# Altium project ConversorSigmaDelta.PrjPcb
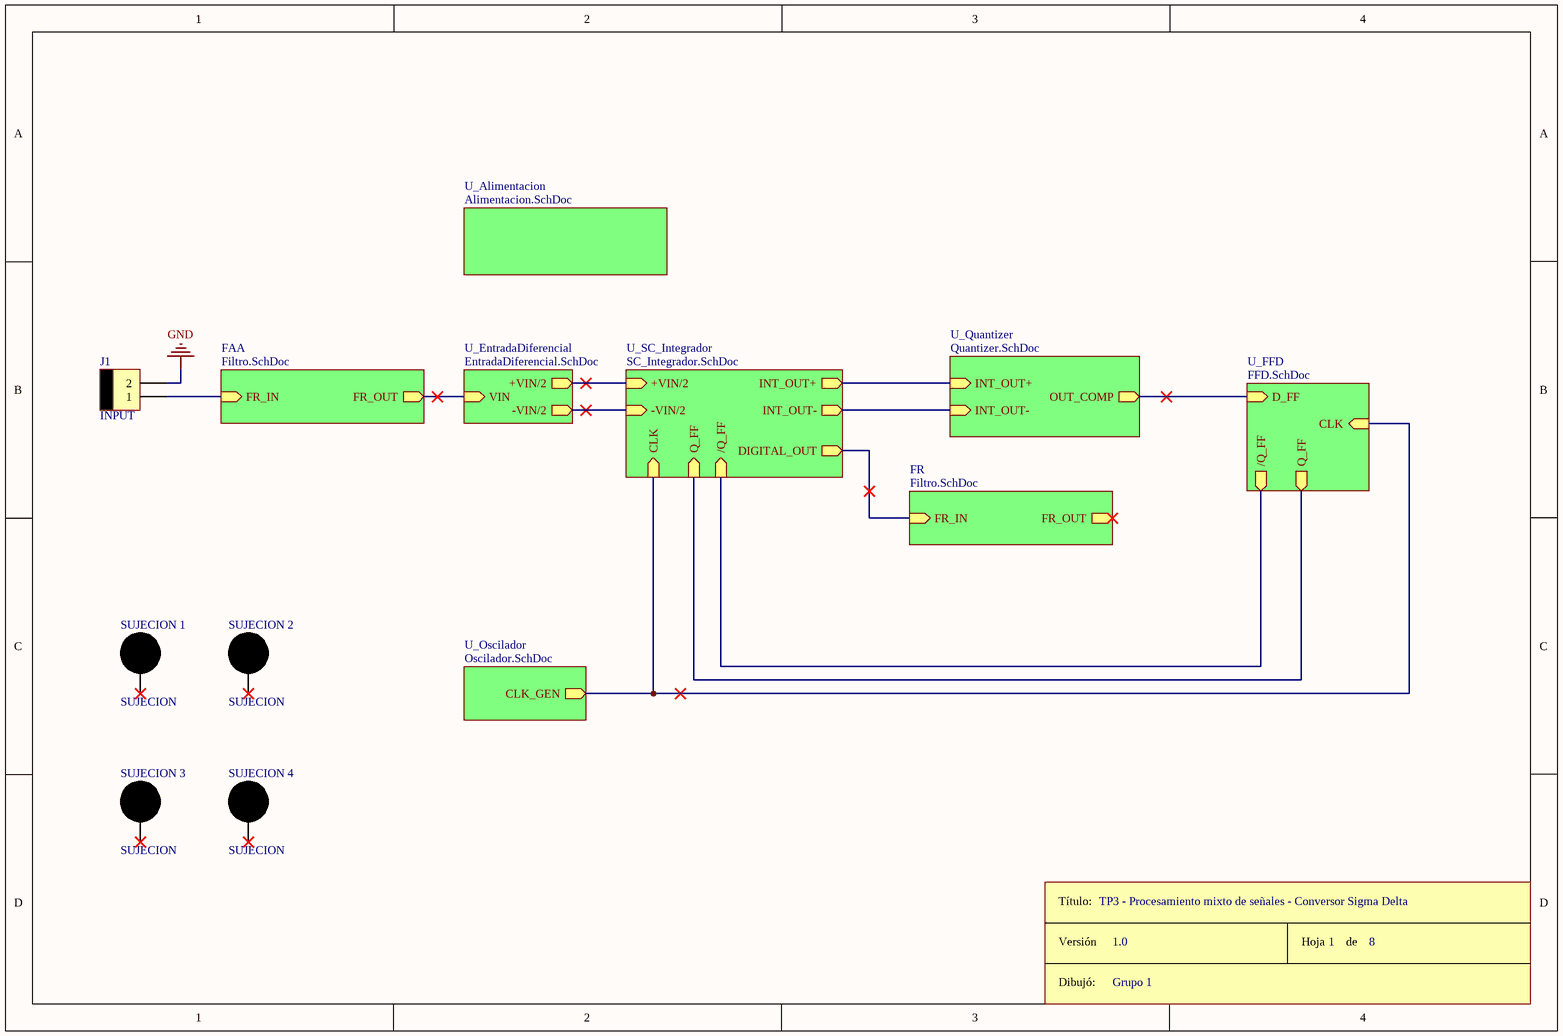
[diagram p0: ConversorSigmaDelta.SchDoc]
8 sheets, 88 parts. Net scope: hierarchical (ports join the sheet entries above them; power ports are global).
Board file: SigmaDelta.PcbDoc
Sheets:
  ConversorSigmaDelta.SchDoc
    U_EntradaDiferencial = EntradaDiferencial.SchDoc
    U_SC_Integrador = SC_Integrador.SchDoc
    U_Quantizer = Quantizer.SchDoc
    U_FFD = FFD.SchDoc
    U_Alimentacion = Alimentacion.SchDoc
    U_Oscilador = Oscilador.SchDoc
    FR = Filtro.SchDoc
    FAA = Filtro.SchDoc

## Sheet ConversorSigmaDelta.SchDoc
size A4

### Parts
J1  INPUT  [MOLEX2]
ROT6  Rótulo  (value not drawn)
SUJECION_1  SUJECION  [SUJECION (5.00MM - 3.50MM)]
SUJECION_2  SUJECION  [SUJECION (5.00MM - 3.50MM)]
SUJECION_3  SUJECION  [SUJECION (5.00MM - 3.50MM)]
SUJECION_4  SUJECION  [SUJECION (5.00MM - 3.50MM)]

### Sub-sheets
FAA = Filtro.SchDoc: FR_IN (in), FR_OUT (out)
FR = Filtro.SchDoc: FR_IN (in), FR_OUT (out)
U_Alimentacion = Alimentacion.SchDoc: no entries
U_EntradaDiferencial = EntradaDiferencial.SchDoc: +VIN/2 (out), -VIN/2 (out), VIN (in)
U_FFD = FFD.SchDoc: D_FF (in), CLK (in), Q_FF (out), /Q_FF (out)
U_Oscilador = Oscilador.SchDoc: CLK_GEN (out)
U_Quantizer = Quantizer.SchDoc: OUT_COMP (out), INT_OUT+ (in), INT_OUT- (in)
U_SC_Integrador = SC_Integrador.SchDoc: INT_OUT+ (out), INT_OUT- (out), Q_FF (in), +VIN/2 (in), /Q_FF (in), -VIN/2 (in), CLK (in), DIGITAL_OUT (out)

### Nets
GND: J1.2
CLK: sheet U_SC_Integrador/CLK, sheet U_FFD/CLK, sheet U_Oscilador/CLK_GEN
DAC_1BIT_A: sheet U_SC_Integrador/DIGITAL_OUT, sheet FR/FR_IN
VIN: sheet U_EntradaDiferencial/VIN, sheet FAA/FR_OUT
NetCa_2: sheet U_SC_Integrador/INT_OUT+, sheet U_Quantizer/INT_OUT+
NetCb_2: sheet U_SC_Integrador/INT_OUT-, sheet U_Quantizer/INT_OUT-
NetJ1_1: J1.1 ; sheet FAA/FR_IN
NetJ5_1: sheet U_SC_Integrador/Q_FF, sheet U_FFD/Q_FF
NetJ6_1: sheet U_Quantizer/OUT_COMP, sheet U_FFD/D_FF
NetR3D_2: sheet U_EntradaDiferencial/+VIN/2, sheet U_SC_Integrador/+VIN/2
NetU1_6: sheet U_EntradaDiferencial/-VIN/2, sheet U_SC_Integrador/-VIN/2
NetU2_2: sheet U_SC_Integrador//Q_FF, sheet U_FFD//Q_FF

Not connected (* = marked no-connect by the designer): SUJECION_1 1*; SUJECION_2 1*; SUJECION_3 1*; SUJECION_4 1*

### Notes on the sheet
- TP3 - Procesamiento mixto de señales - Conversor Sigma Delta
- 1.0
- Grupo 1
- 1
- 8
- (in symbol Rótulo) Título:; Versión; Hoja       de; Dibujó:

### Library data of the parts
J1 = MOLEX2

## Sheet EntradaDiferencial.SchDoc
size A4
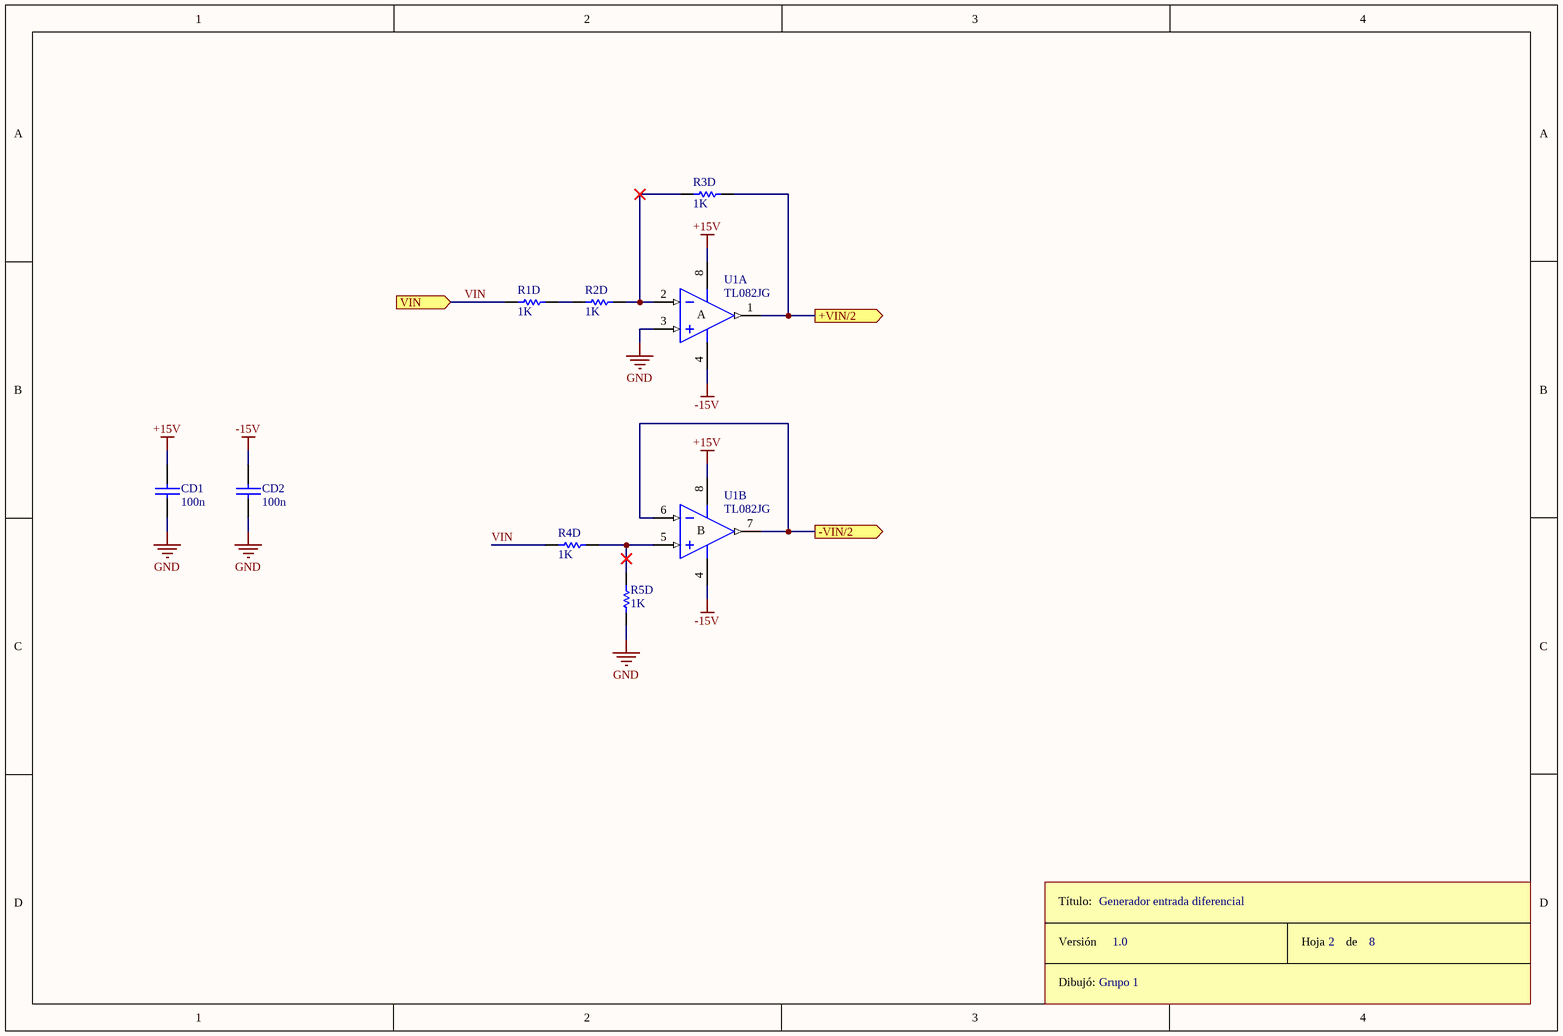
[diagram p1: EntradaDiferencial.SchDoc]

### Parts
CD1  100n  [CAP100]
CD2  100n  [CAP100]
R1D  1K  [RES300]
R2D  1K  [RES300]
R3D  1K  [RES300]
R4D  1K  [RES300]
R5D  1K  [RES300]
ROT1  Rótulo  (value not drawn)
U1  TL082JG  [JG008]  (parts A,B of 2)

### Ports
+VIN/2 (out), -VIN/2 (out), VIN (in)

### Nets
+15V: CD1.1 U1.8(V+)
-15V: CD2.1 U1.4(V-)
GND: CD1.2 CD2.2 R5D.1 U1.3(IN+)
VIN: R1D.2 R4D.2 ; port VIN
NetR1D_1: R1D.1 R2D.1
NetR2D_2: R2D.2 R3D.1 U1.2(IN-)
NetR3D_2: R3D.2 U1.1(OUT) ; port +VIN/2
NetR4D_1: R4D.1 R5D.2 U1.5(IN+)
NetU1_6: U1.6(IN-) U1.7(OUT) ; port -VIN/2

### Notes on the sheet
- Generador entrada diferencial
- Grupo 1
- 1.0
- 2
- 8
- (in symbol Rótulo) Título:; Versión; Hoja       de; Dibujó:
- (in symbol TL082JG, part A) A
- (in symbol TL082JG, part B) B

### Library data of the parts
CD1 CD2 = CAP
R1D R2D R3D R4D R5D = RES
U1 = TL082JG: JFET-Input Operational Amplifier; Published: 16-Jan-2001; LatestRevisionDate: 04-Mar-2005; LatestRevisionNote: Stylized 3D Model Added.; DatasheetVersion: Feb-1999; PackageVersion: Jan-1995; PackageReference: JG008; Publisher: Altium Limited; PackageDescription: DIP; 8 Leads; Row Spacing 7.62 mm; Pitch 2.54 mm; ComponentLink1Description: Manufacturer Link; ComponentLink1URL: http://www.ti.com/; ComponentLink2Description: Datasheet; ComponentLink2URL: http://www-s.ti.com/sc/ds/tl082.pdf

## Sheet SC_Integrador.SchDoc
size A4
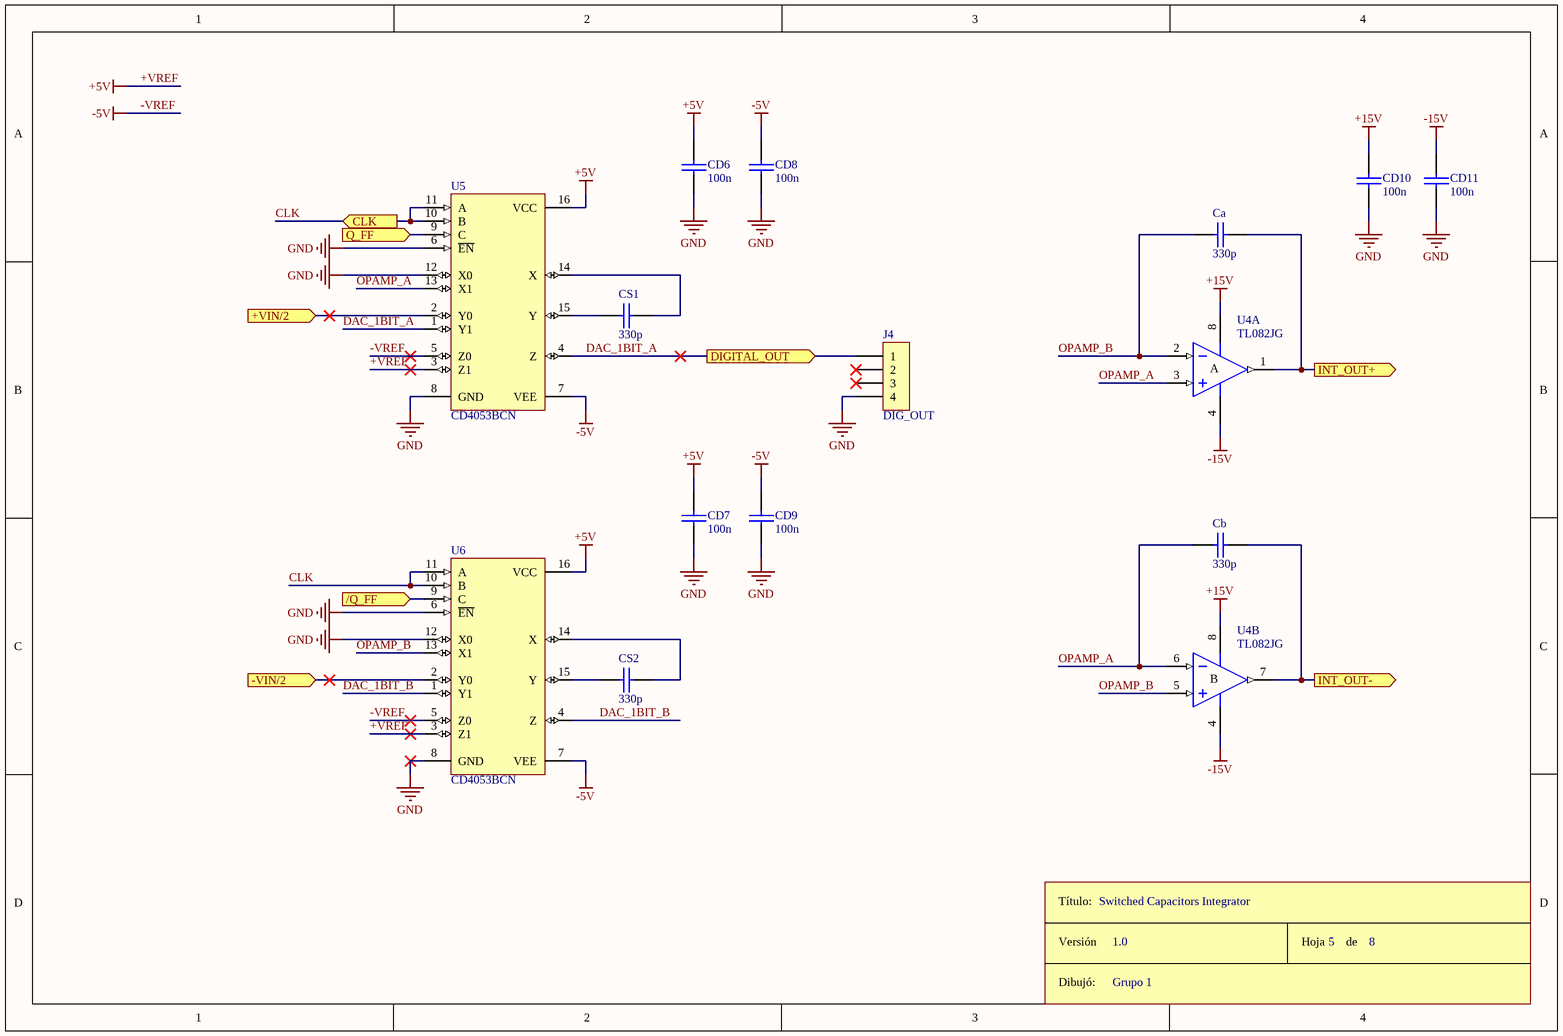
[diagram p2: SC_Integrador.SchDoc]

### Parts
Ca  330p  [CAP100]
Cb  330p  [CAP100]
CD6  100n  [CAP100]
CD7  100n  [CAP100]
CD8  100n  [CAP100]
CD9  100n  [CAP100]
CD10  100n  [CAP100]
CD11  100n  [CAP100]
CS1  330p  [CAP100]
CS2  330p  [CAP100]
J4  DIG_OUT  [SIP4]
ROT4  Rótulo  (value not drawn)
U4  TL082JG  [JG008]  (parts A,B of 2)
U5  CD4053BCN  [N16E]
U6  CD4053BCN  [N16E]

### Ports
+VIN/2 (in), -VIN/2 (in), /Q_FF (in), CLK (in), DIGITAL_OUT (out), INT_OUT+ (out), INT_OUT- (out), Q_FF (in)

### Nets
+15V: CD10.1 U4.8(V+)
+VREF: CD6.1 CD7.1 U5.3(Z1) U5.16(VCC) U6.3(Z1) U6.16(VCC)  [also labelled +5V]
-15V: CD11.1 U4.4(V-)
-VREF: CD8.1 CD9.1 U5.5(Z0) U5.7(VEE) U6.5(Z0) U6.7(VEE)  [also labelled -5V]
GND: CD6.2 CD7.2 CD8.2 CD9.2 CD10.2 CD11.2 J4.4 U5.6(~{EN}) U5.8(GND) U5.12(X0) U6.6(~{EN}) U6.8(GND) U6.12(X0)
CLK: U5.10(B) U5.11(A) U6.10(B) U6.11(A) ; port CLK
DAC_1BIT_A: J4.1 U5.1(Y1) U5.4(Z) ; port DIGITAL_OUT
DAC_1BIT_B: U6.1(Y1) U6.4(Z)
OPAMP_A: Cb.1 U4.3(IN+) U4.6(IN-) U5.13(X1)
OPAMP_B: Ca.1 U4.2(IN-) U4.5(IN+) U6.13(X1)
NetCa_2: Ca.2 U4.1(OUT) ; port INT_OUT+
NetCb_2: Cb.2 U4.7(OUT) ; port INT_OUT-
NetCS1_1: CS1.1 U5.14(X)
NetCS1_2: CS1.2 U5.15(Y)
NetCS2_1: CS2.1 U6.15(Y)
NetCS2_2: CS2.2 U6.14(X)
NetJ5_1: U5.9(C) ; port Q_FF
NetR3D_2: U5.2(Y0) ; port +VIN/2
NetU1_6: U6.2(Y0) ; port -VIN/2
NetU2_2: U6.9(C) ; port /Q_FF

Not connected (* = marked no-connect by the designer): J4 2* 3*

### Notes on the sheet
- Switched Capacitors Integrator
- 1.0
- Grupo 1
- 5
- 8
- (in symbol Rótulo) Título:; Versión; Hoja       de; Dibujó:
- (in symbol TL082JG, part A) A
- (in symbol TL082JG, part B) B

### Library data of the parts
Ca Cb CD6-CD11 CS1 CS2 = CAP
J4 = CON4
U4 = TL082JG: JFET-Input Operational Amplifier; Published: 16-Jan-2001; LatestRevisionDate: 04-Mar-2005; LatestRevisionNote: Stylized 3D Model Added.; DatasheetVersion: Feb-1999; PackageVersion: Jan-1995; PackageReference: JG008; Publisher: Altium Limited; PackageDescription: DIP; 8 Leads; Row Spacing 7.62 mm; Pitch 2.54 mm; ComponentLink1Description: Manufacturer Link; ComponentLink1URL: http://www.ti.com/; ComponentLink2Description: Datasheet; ComponentLink2URL: http://www-s.ti.com/sc/ds/tl082.pdf
U5 U6 = CD4053BCN: Triple 2-Channnel Analog Multiplexer/Demutiplexer; Published: 17-Jul-2002; LatestRevisionDate: 29-May-2009; LatestRevisionNote: Component Body Added.; DatasheetVersion: Jan-1999; PackageVersion: 2000; PackageReference: N16E; Publisher: Altium Limited; PackageDescription: DIP, 16-Pin, Row Spacing 7.62 mm, Pitch 2.54 mm; ComponentLink1Description: Manufacturer Link; ComponentLink1URL: http://www.fairchildsemi.com/; ComponentLink2Description: Datasheet; ComponentLink2URL: http://www.fairchildsemi.com/ds/CD%2FCD4052BC.pdf

## Sheet Quantizer.SchDoc
size A4
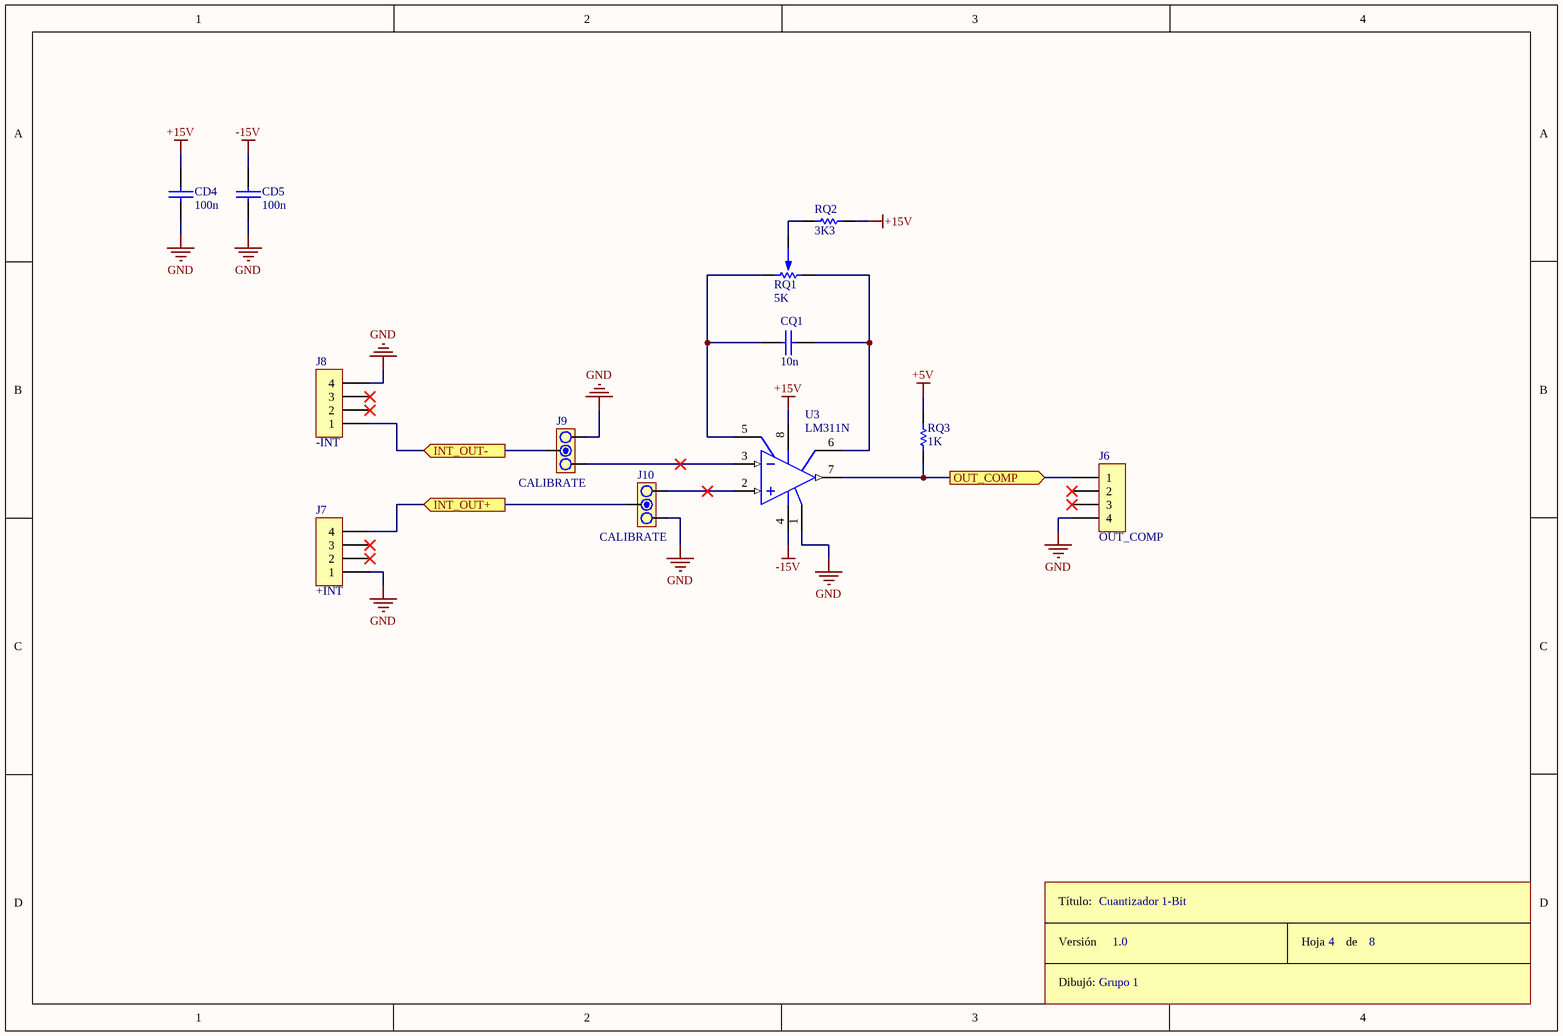
[diagram p3: Quantizer.SchDoc]

### Parts
CD4  100n  [CAP100]
CD5  100n  [CAP100]
CQ1  10n  [CAP100]
J6  OUT_COMP  [SIP4]
J7  +INT  [SIP4]
J8  -INT  [SIP4]
J9  CALIBRATE  [JUMPER3]
J10  CALIBRATE  [JUMPER3]
ROT3  Rótulo  (value not drawn)
RQ1  5K  [PRESET V]
RQ2  3K3  [RES300]
RQ3  1K  [RES300]
U3  LM311N  [626-05]

### Ports
INT_OUT+ (in), INT_OUT- (in), OUT_COMP (out)

### Nets
+5V: RQ3.2  [project net +VREF]
+15V: CD4.1 RQ2.2 U3.8(V+)
-15V: CD5.1 U3.4(V-)
GND: CD4.2 CD5.2 J6.4 J7.1 J8.4 J9.1 J10.3 U3.1(GND)
NetCa_2: J7.4 J10.2 ; port INT_OUT+
NetCb_2: J8.1 J9.2 ; port INT_OUT-
NetCQ1_1: CQ1.1 RQ1.1 U3.5(BAL)
NetCQ1_2: CQ1.2 RQ1.3 U3.6(BAL/STB)
NetJ6_1: J6.1 RQ3.1 U3.7(OUT) ; port OUT_COMP
NetJ9_3: J9.3 U3.3(IN-)
NetJ10_1: J10.1 U3.2(IN+)
NetRQ1_2: RQ1.2 RQ2.1

Not connected (* = marked no-connect by the designer): J6 2* 3*; J7 2* 3*; J8 2* 3*

### Notes on the sheet
- Cuantizador 1-Bit
- Grupo 1
- 1.0
- 4
- 8
- (in symbol Rótulo) Título:; Versión; Hoja       de; Dibujó:

### Library data of the parts
CD4 CD5 CQ1 = CAP
J6-J8 = CON4
J9 J10 = JUMPER3
RQ1 = PRESET
RQ2 RQ3 = RES
U3 = LM311N: High-Performance Voltage Comparator; Published: 17-Jul-2002; LatestRevisionDate: 06-Jun-2005; LatestRevisionNote: Stylized 3D Model Added.; DatasheetVersion: 1988; PackageReference: 626-05; Publisher: Altium Limited; PackageDescription: DIP; 8 Leads; Row Spacing 7.62 mm; Pitch 2.54 mm; ComponentLink1Description: Manufacturer Link; ComponentLink1URL: http://www.onsemi.com/site/products/taxonomy/0,4438,133,00.html

## Sheet FFD.SchDoc
size A4
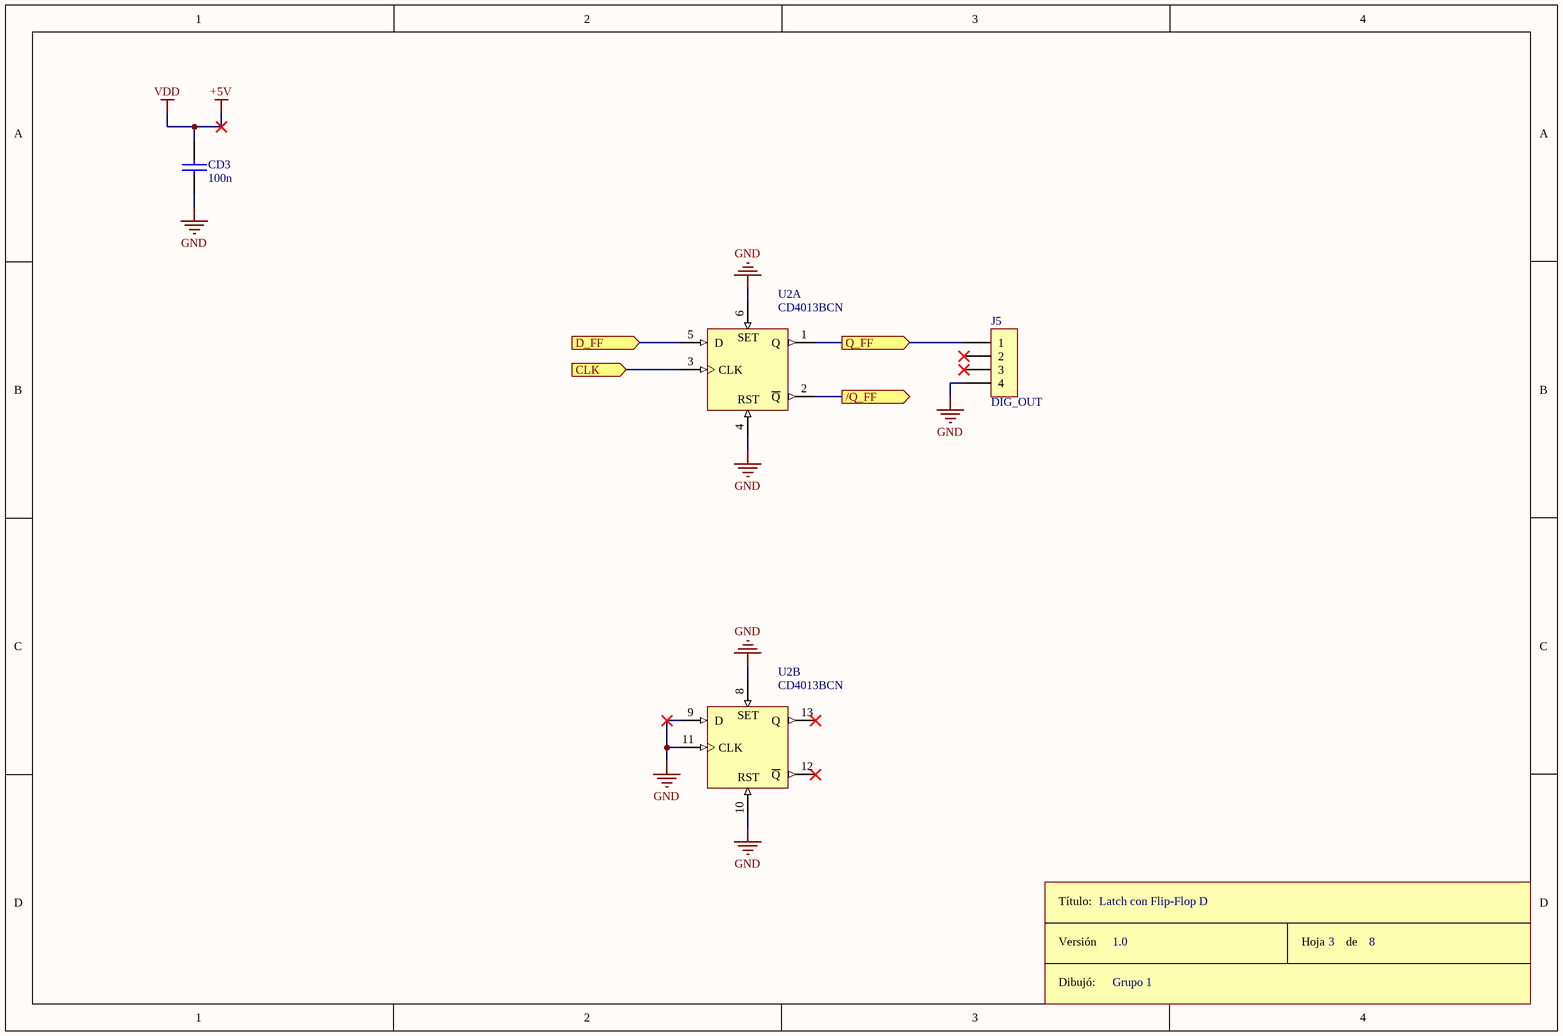
[diagram p4: FFD.SchDoc]

### Parts
CD3  100n  [CAP100]
J5  DIG_OUT  [SIP4]
ROT2  Rótulo  (value not drawn)
U2  CD4013BCN  [N14A]  (parts A,B of 2)

### Ports
/Q_FF (out), CLK (in), D_FF (in), Q_FF (out)

### Nets
+5V: CD3.1 U2.14(VDD)  [also labelled VDD]  [project net +VREF]
GND: CD3.2 J5.4 U2.4(RST) U2.6(S) U2.7(GND) U2.8(S) U2.9(D) U2.10(RST) U2.11(CLK)
CLK: U2.3(CLK) ; port CLK
NetJ5_1: J5.1 U2.1(Q) ; port Q_FF
NetJ6_1: U2.5(D) ; port D_FF
NetU2_2: U2.2(~{Q}) ; port /Q_FF

Not connected (* = marked no-connect by the designer): J5 2* 3*; U2 12(~{Q})* 13(Q)*

### Notes on the sheet
- Latch con Flip-Flop D
- 1.0
- Grupo 1
- 3
- 8
- (in symbol CD4013BCN, part A) SET
- (in symbol CD4013BCN, part B) SET
- (in symbol Rótulo) Título:; Versión; Hoja       de; Dibujó:

### Library data of the parts
CD3 = CAP
J5 = CON4
U2 = CD4013BCN: Dual D-Type Flip-Flop; Published: 17-Jul-2002; LatestRevisionDate: 29-May-2009; LatestRevisionNote: Component Body Added.; DatasheetVersion: Jan-1999; PackageVersion: 2000; PackageReference: N14A; Publisher: Altium Limited; PackageDescription: DIP, 14-Pin, Row Spacing 7.62 mm, Pitch 2.54 mm; ComponentLink1Description: Manufacturer Link; ComponentLink1URL: http://www.fairchildsemi.com/

## Sheet Alimentacion.SchDoc
size A4
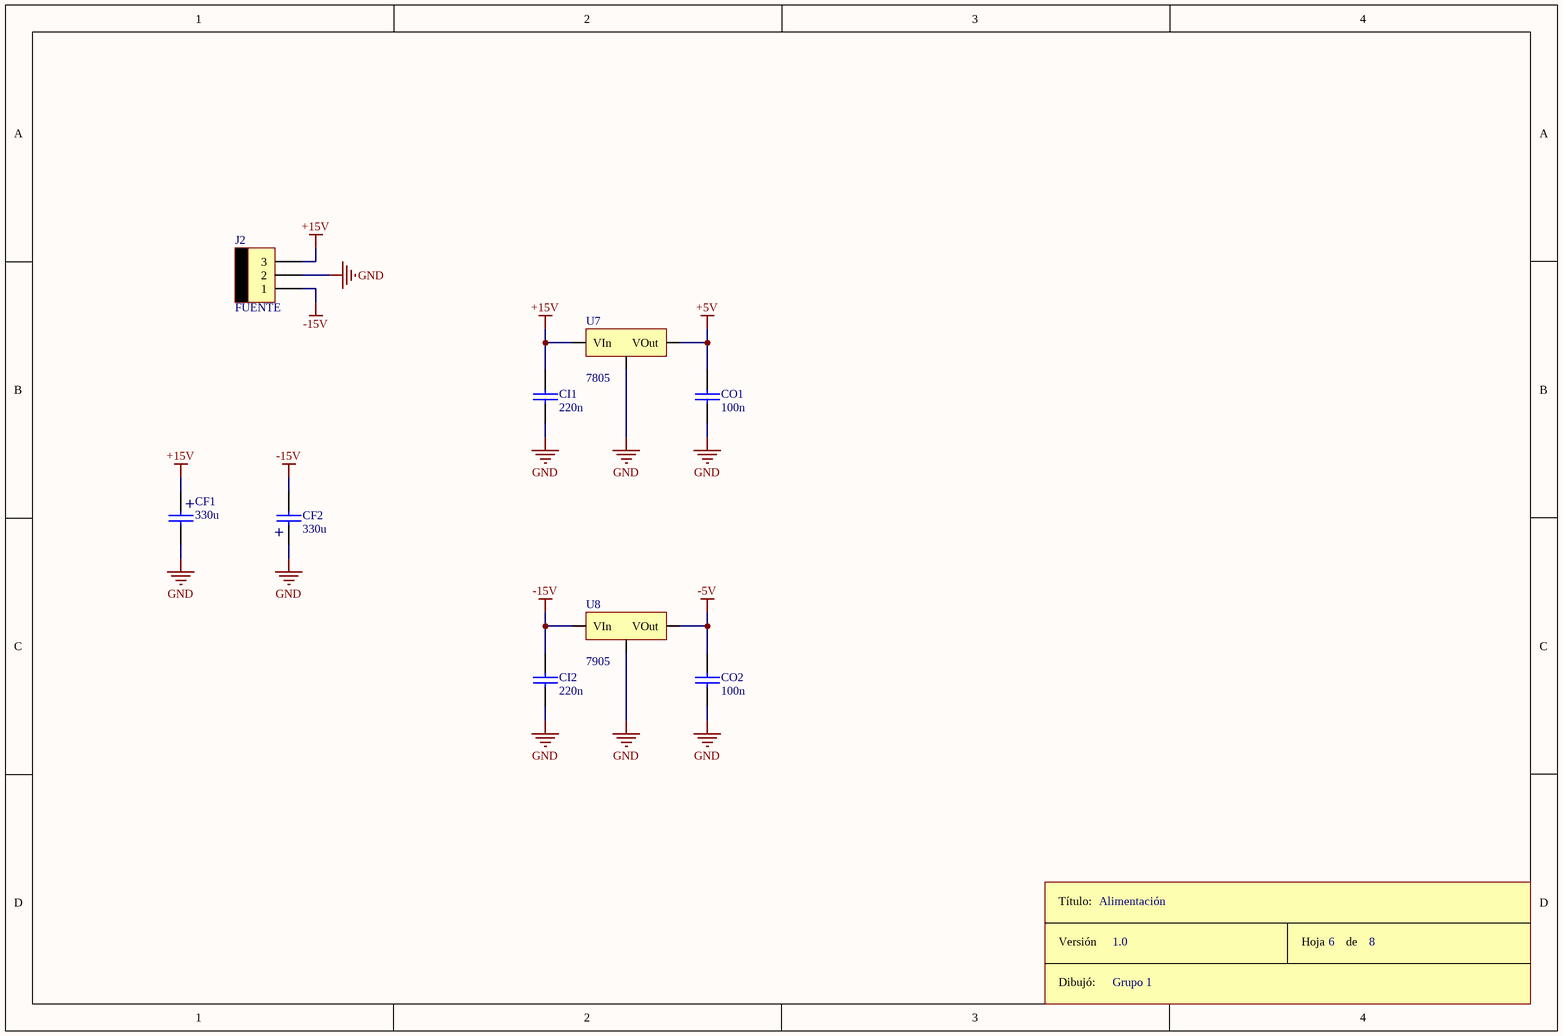
[diagram p5: Alimentacion.SchDoc]

### Parts
CF1  330u  [CAP200RP]
CF2  330u  [CAP200RP]
CI1  220n  [CAP100]
CI2  220n  [CAP100]
CO1  100n  [CAP100]
CO2  100n  [CAP100]
J2  FUENTE  [MOLEX3]
ROT5  Rótulo  (value not drawn)
U7  7805  [TO-220 V]
U8  7905  [TO-220 V]

### Nets
+5V: CO1.1 U7.3(VOut)  [project net +VREF]
+15V: CF1.1 CI1.1 J2.3 U7.1(VIn)
-5V: CO2.1 U8.3(VOut)  [project net -VREF]
-15V: CF2.2 CI2.1 J2.1 U8.2(VIn)
GND: CF1.2 CF2.1 CI1.2 CI2.2 CO1.2 CO2.2 J2.2 U7.2(GND) U8.1(GND)

### Notes on the sheet
- Alimentación
- 1.0
- Grupo 1
- 6
- 8
- (in symbol CAPPOL) +
- (in symbol Rótulo) Título:; Versión; Hoja       de; Dibujó:

### Library data of the parts
CF1 CF2 = CAPPOL
CI1 CI2 CO1 CO2 = CAP
J2 = MOLEX3
U7 = 78XX: REGULDOR POSITIVO
U8 = 79XX: REGULADOR NEGATIVO

## Sheet Oscilador.SchDoc
size A4
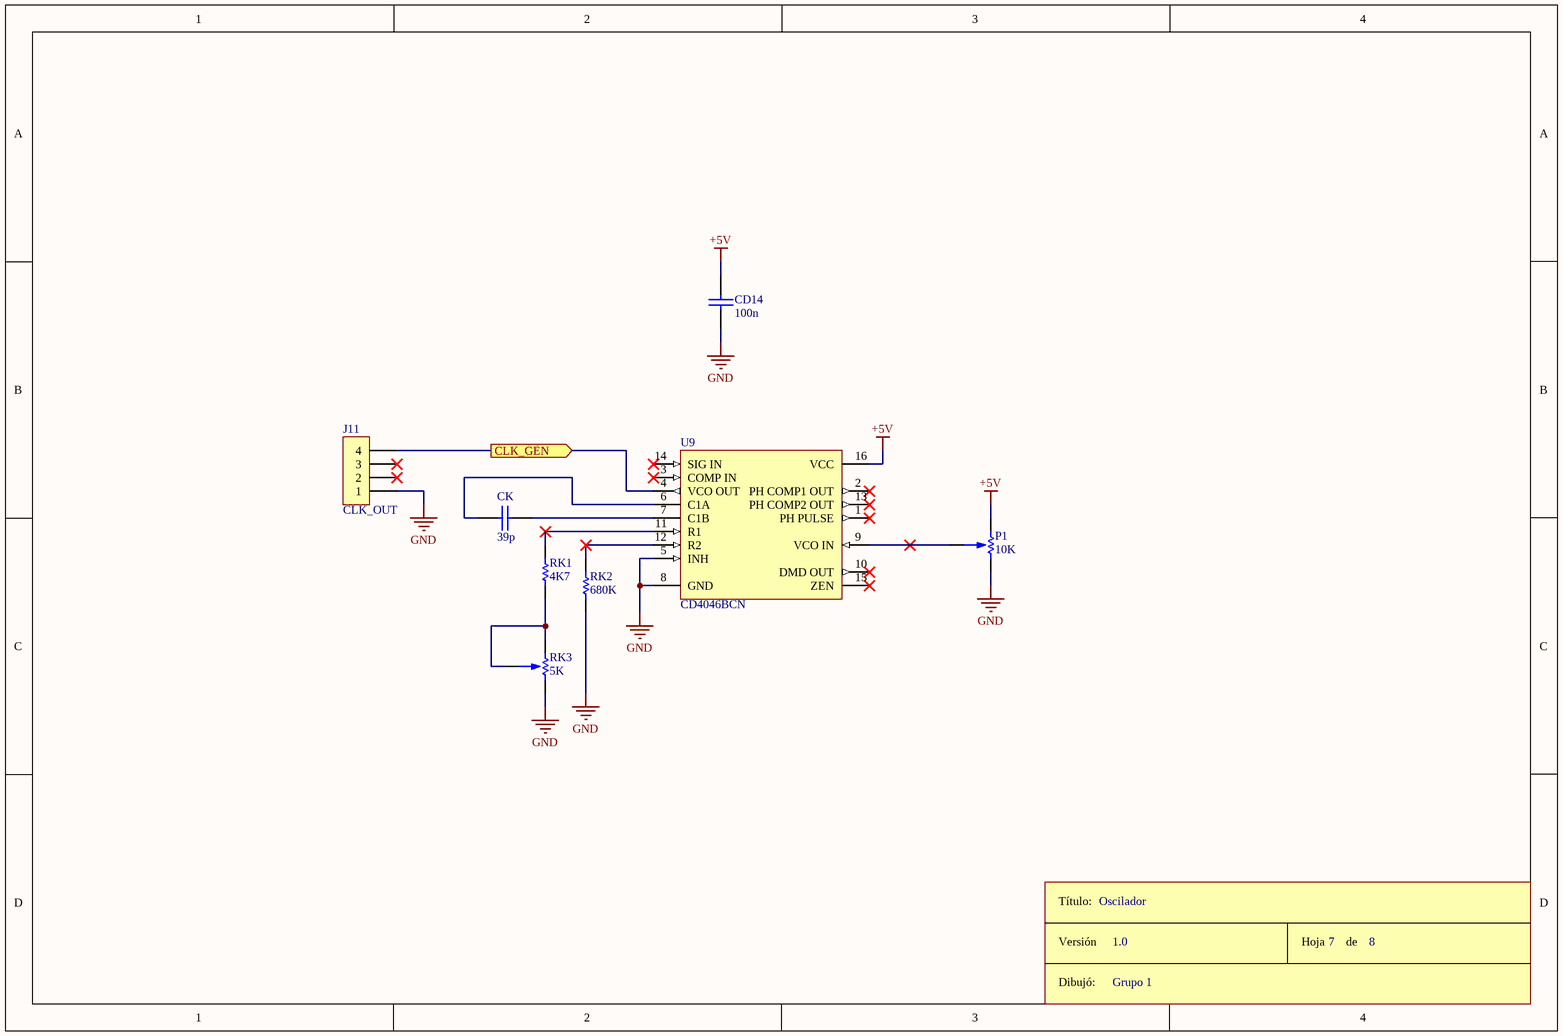
[diagram p6: Oscilador.SchDoc]

### Parts
CD14  100n  [CAP100]
CK  39p  [CAP100]
J11  CLK_OUT  [SIP4]
P1  10K  [PRESET V]
RK1  4K7  [RES300]
RK2  680K  [RES300]
RK3  5K  [PRESET V]
ROT7  Rótulo  (value not drawn)
U9  CD4046BCN  [N16E]

### Ports
CLK_GEN (out)

### Nets
+5V: CD14.1 P1.3 U9.16(VCC)  [project net +VREF]
GND: CD14.2 J11.1 P1.1 RK2.1 RK3.1 U9.5(INH) U9.8(GND)
CLK: J11.4 U9.4(VCO_OUT) ; port CLK_GEN
NetCK_1: CK.1 U9.6(C1A)
NetCK_2: CK.2 U9.7(C1B)
NetP1_2: P1.2 U9.9(VCO_IN)
NetRK1_1: RK1.1 RK3.2 RK3.3
NetRK1_2: RK1.2 U9.11(R1)
NetRK2_2: RK2.2 U9.12(R2)

Not connected (* = marked no-connect by the designer): J11 2* 3*; U9 1(PH_PULSE)* 2(PH_COMP1_OUT)* 3(COMP_IN)* 10(DMD_OUT)* 13(PH_COMP2_OUT)* 14(SIG_IN)* 15(ZEN)*

### Notes on the sheet
- Oscilador
- 1.0
- Grupo 1
- 7
- 8
- (in symbol Rótulo) Título:; Versión; Hoja       de; Dibujó:

### Library data of the parts
CD14 CK = CAP
J11 = CON4
P1 RK3 = PRESET
RK1 RK2 = RES
U9 = CD4046BCN: Micropower Phase-Locked Loop; Published: 17-Jul-2002; LatestRevisionDate: 04-Mar-2005; LatestRevisionNote: Stylized 3D Model Added.; DatasheetVersion: Jan-1999; PackageVersion: 2000; PackageReference: N16E; Publisher: Altium Limited; PackageDescription: DIP; 16 Leads; Row Spacing 7.62 mm; Pitch 2.54 mm; ComponentLink1Description: Manufacturer Link; ComponentLink1URL: http://www.fairchildsemi.com/; ComponentLink2Description: Datasheet; ComponentLink2URL: http://www.fairchildsemi.com/ds/CD%2FCD4046BC.pdf

## Sheet Filtro.SchDoc
size A4
Used 2 times, as channels FR, FAA. Parts and nets are listed once, with the designators drawn on the sheet.
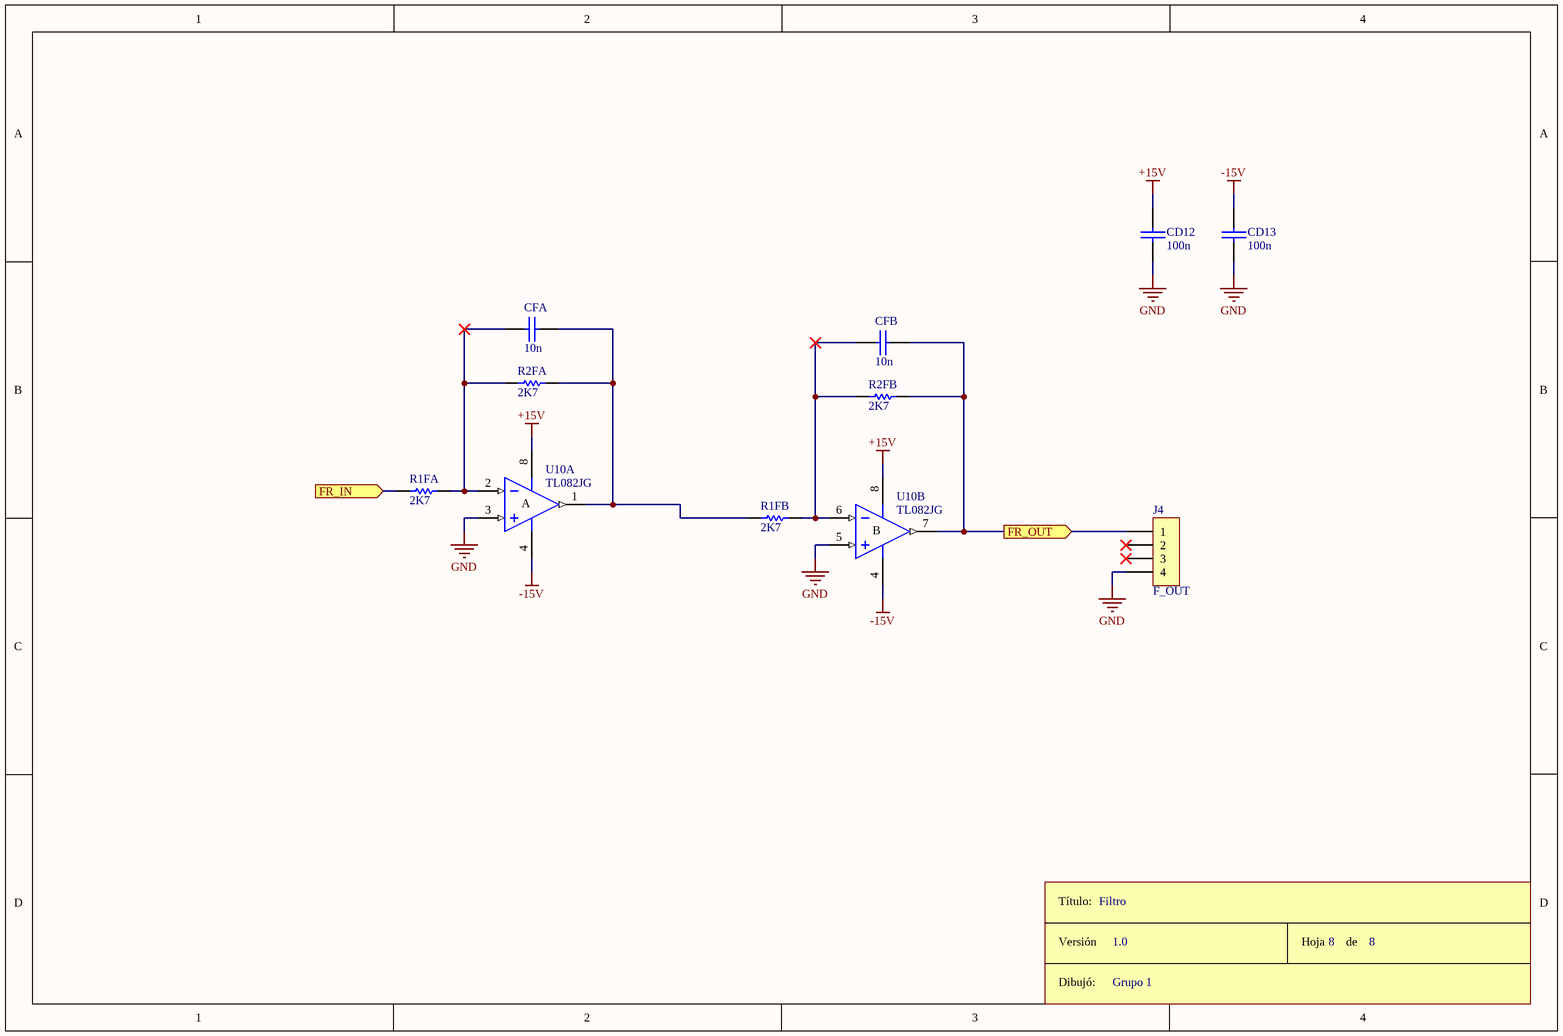
[diagram p7: Filtro.SchDoc]

### Parts
CD12  100n  [CAP100]
CD13  100n  [CAP100]
CFA  10n  [CAP100]
CFB  10n  [CAP100]
J4  F_OUT  [SIP4]
R1FA  2K7  [RES300]
R1FB  2K7  [RES400]
R2FA  2K7  [RES300]
R2FB  2K7  [RES300]
ROT8  Rótulo  (value not drawn)
U10  TL082JG  [JG008]  (parts A,B of 2)

### Ports
FR_IN (in), FR_OUT (out)

### Nets
+15V: CD12.1 U10.8(V+)
-15V: CD13.1 U10.4(V-)
GND: CD12.2 CD13.2 J4.4 U10.3(IN+) U10.5(IN+)
FR_IN: R1FA.1 ; port FR_IN
FR_OUT: CFB.2 J4.1 R2FB.2 U10.7(OUT) ; port FR_OUT
NetCFA_1: CFA.1 R1FA.2 R2FA.1 U10.2(IN-)
NetCFA_2: CFA.2 R1FB.1 R2FA.2 U10.1(OUT)
NetCFB_1: CFB.1 R1FB.2 R2FB.1 U10.6(IN-)

Not connected (* = marked no-connect by the designer): J4 2* 3*

### Channels
FR: designators end in _FR; ports FR_IN=DAC_1BIT_A FR_OUT=NetCFB_FR_2
FAA: designators end in _FAA; ports FR_IN=NetJ1_1 FR_OUT=VIN

### Notes on the sheet
- Filtro
- 1.0
- Grupo 1
- 8
- (in symbol Rótulo) Título:; Versión; Hoja       de; Dibujó:
- (in symbol TL082JG, part A) A
- (in symbol TL082JG, part B) B

### Library data of the parts
CD12 CD13 CFA CFB = CAP
J4 = CON4
R1FA R1FB R2FA R2FB = RES
U10 = TL082JG: JFET-Input Operational Amplifier; Published: 16-Jan-2001; LatestRevisionDate: 04-Mar-2005; LatestRevisionNote: Stylized 3D Model Added.; DatasheetVersion: Feb-1999; PackageVersion: Jan-1995; PackageReference: JG008; Publisher: Altium Limited; PackageDescription: DIP; 8 Leads; Row Spacing 7.62 mm; Pitch 2.54 mm; ComponentLink1Description: Manufacturer Link; ComponentLink1URL: http://www.ti.com/; ComponentLink2Description: Datasheet; ComponentLink2URL: http://www-s.ti.com/sc/ds/tl082.pdf

## Nets that join several sheets
+15V: EntradaDiferencial (CD1.1 U1.8), SC_Integrador (CD10.1 U4.8), Quantizer (CD4.1 RQ2.2 U3.8), Alimentacion (CF1.1 CI1.1 J2.3 U7.1), FR (CD12_FR.1 U10_FR.8), FAA (CD12_FAA.1 U10_FAA.8)
+VREF: SC_Integrador (6 pins), Quantizer (RQ3.2), FFD (CD3.1 U2.14), Alimentacion (CO1.1 U7.3), Oscilador (CD14.1 P1.3 U9.16)
-15V: EntradaDiferencial (CD2.1 U1.4), SC_Integrador (CD11.1 U4.4), Quantizer (CD5.1 U3.4), Alimentacion (CF2.2 CI2.1 J2.1 U8.2), FR (CD13_FR.1 U10_FR.4), FAA (CD13_FAA.1 U10_FAA.4)
-VREF: SC_Integrador (6 pins), Alimentacion (CO2.1 U8.3)
GND: ConversorSigmaDelta (J1.2), EntradaDiferencial (CD1.2 CD2.2 R5D.1 U1.3), SC_Integrador (13 pins), Quantizer (8 pins), FFD (9 pins), Alimentacion (9 pins), Oscilador (7 pins), FR (5 pins), FAA (5 pins)
CLK: SC_Integrador (U5.10 U5.11 U6.10 U6.11), FFD (U2.3), Oscilador (J11.4 U9.4)
DAC_1BIT_A: SC_Integrador (J4.1 U5.1 U5.4), FR (R1FA_FR.1)
NetCa_2: SC_Integrador (Ca.2 U4.1), Quantizer (J7.4 J10.2)
NetCb_2: SC_Integrador (Cb.2 U4.7), Quantizer (J8.1 J9.2)
NetJ1_1: ConversorSigmaDelta (J1.1), FAA (R1FA_FAA.1)
NetJ5_1: SC_Integrador (U5.9), FFD (J5.1 U2.1)
NetJ6_1: Quantizer (J6.1 RQ3.1 U3.7), FFD (U2.5)
NetR3D_2: EntradaDiferencial (R3D.2 U1.1), SC_Integrador (U5.2)
NetU1_6: EntradaDiferencial (U1.6 U1.7), SC_Integrador (U6.2)
NetU2_2: SC_Integrador (U6.9), FFD (U2.2)
VIN: EntradaDiferencial (R1D.2 R4D.2), FAA (CFB_FAA.2 J4_FAA.1 R2FB_FAA.2 U10_FAA.7)